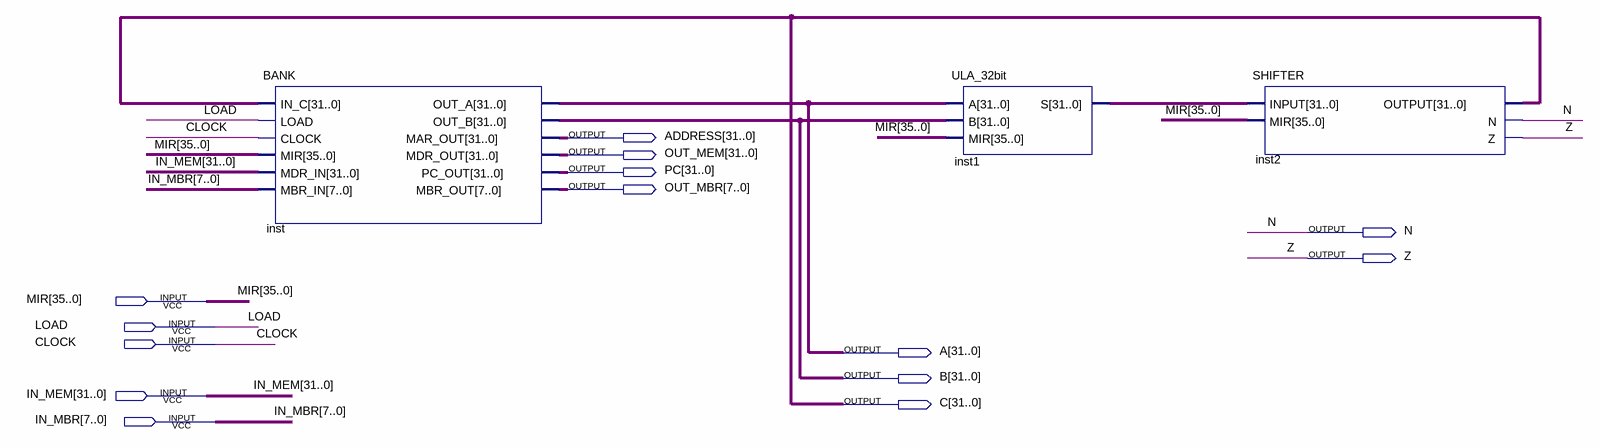
[diagram p0: schematic sheet]
// Quartus schematic DATAPATH.bdf as structural Verilog: 3 symbols, 14 pins
module DATAPATH (
  input  [35:0] MIR,
  input  LOAD,
  input  CLOCK,
  input  [31:0] IN_MEM,
  input  [7:0] IN_MBR,
  output [31:0] ADDRESS,
  output [31:0] OUT_MEM,
  output [31:0] PC,
  output [7:0] OUT_MBR,
  output N,
  output Z,
  output [31:0] A,
  output [31:0] B,
  output [31:0] C
);

  wire [31:0] inst1_s;

  BANK inst (
    .IN_C(C), .LOAD(LOAD), .CLOCK(CLOCK), .MIR(MIR), .MDR_IN(IN_MEM), .MBR_IN(IN_MBR), .OUT_A(A), .OUT_B(B),
    .MAR_OUT(ADDRESS), .MDR_OUT(OUT_MEM), .PC_OUT(PC), .MBR_OUT(OUT_MBR));
  ULA_32bit inst1 (.A(A), .B(B), .MIR(MIR), .S(inst1_s));
  SHIFTER inst2 (.INPUT(inst1_s), .MIR(MIR), .OUTPUT(C), .N(N), .Z(Z));
endmodule
